# Altium schematic sheet SCIENCE.SchDoc
size A4; SheetNumber: 1; SheetTotal: 2
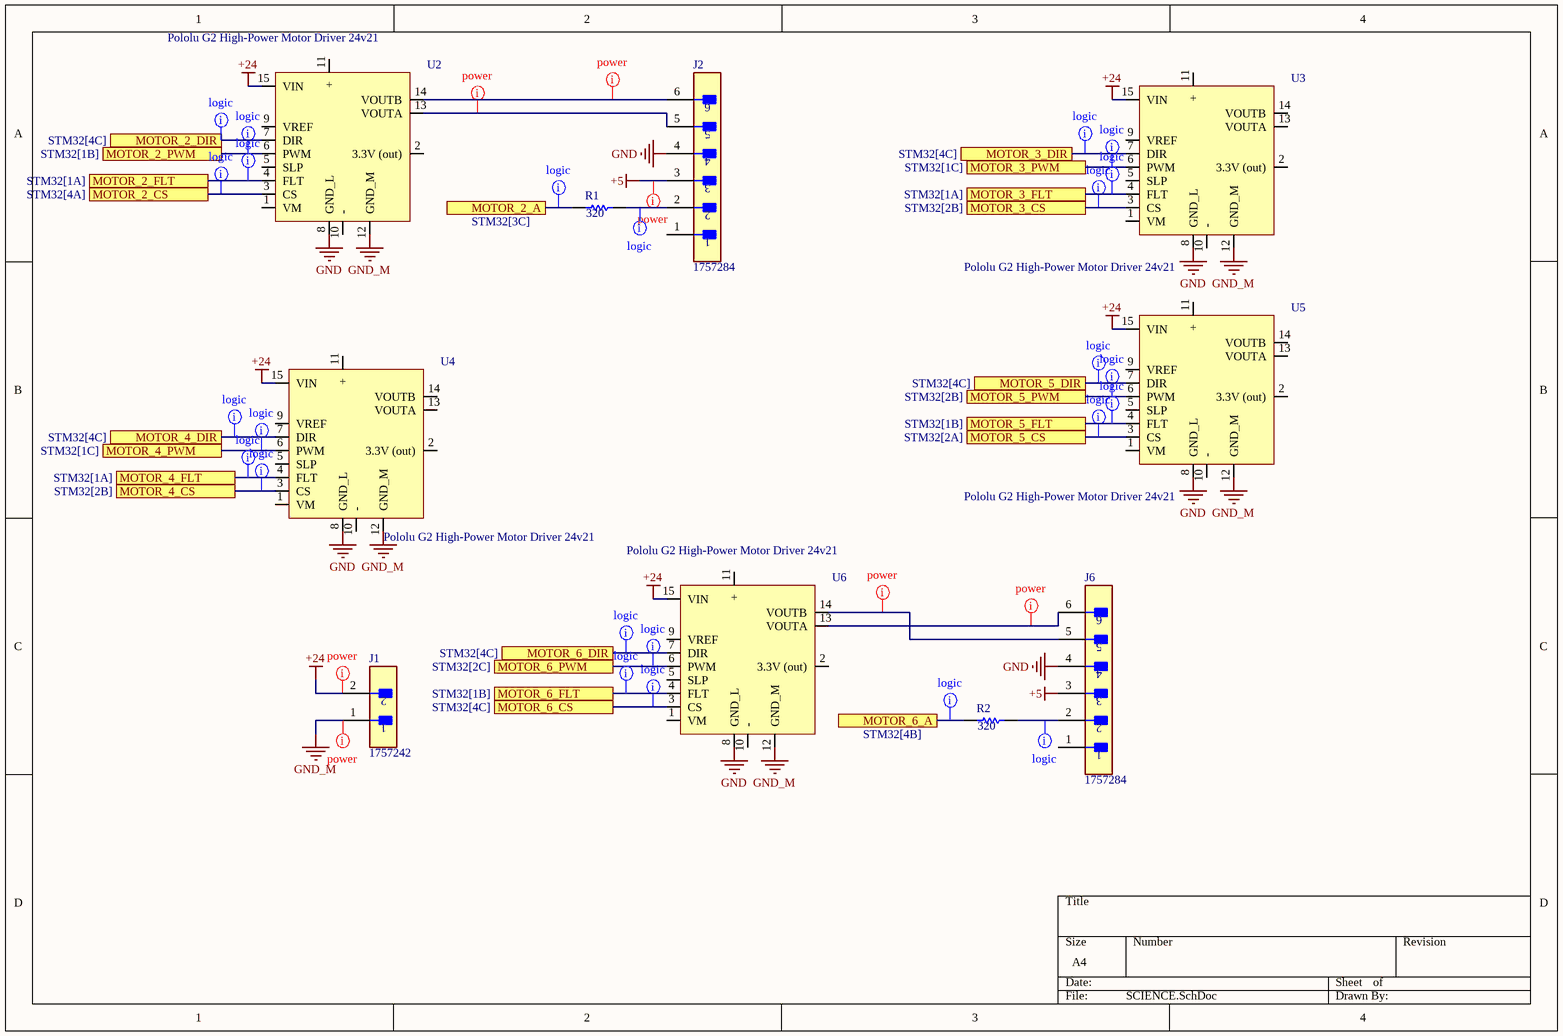
[diagram p0: SCIENCE.SchDoc]

## Parts
J1  1757242  [FP-1757242-MFG]
J2  1757284  [FP-1757284-MFG]
J6  1757284  [FP-1757284-MFG]
R1  value 320  [AXIAL-0.3]  (hidden comment: Res1)
R2  value 320  [AXIAL-0.3]  (hidden comment: Res1)
U2  Pololu G2 High-Power Motor Driver 24v21  [Pololu G2 High-Power Motor Driver 24v21]
U3  Pololu G2 High-Power Motor Driver 24v21  [Pololu G2 High-Power Motor Driver 24v21]
U4  Pololu G2 High-Power Motor Driver 24v21  [Pololu G2 High-Power Motor Driver 24v21]
U5  Pololu G2 High-Power Motor Driver 24v21  [Pololu G2 High-Power Motor Driver 24v21]
U6  Pololu G2 High-Power Motor Driver 24v21  [Pololu G2 High-Power Motor Driver 24v21]

## Ports
MOTOR_2_A (see STM32[3C]), MOTOR_2_CS (see STM32[4A]), MOTOR_2_DIR (see STM32[4C]), MOTOR_2_FLT (see STM32[1A]), MOTOR_2_PWM (see STM32[1B]), MOTOR_3_CS (see STM32[2B]), MOTOR_3_DIR (see STM32[4C]), MOTOR_3_FLT (see STM32[1A]), MOTOR_3_PWM (see STM32[1C]), MOTOR_4_CS (see STM32[2B]), MOTOR_4_DIR (see STM32[4C]), MOTOR_4_FLT (see STM32[1A]), MOTOR_4_PWM (see STM32[1C]), MOTOR_5_CS (see STM32[2A]), MOTOR_5_DIR (see STM32[4C]), MOTOR_5_FLT (see STM32[1B]), MOTOR_5_PWM (see STM32[2B]), MOTOR_6_A (see STM32[4B]), MOTOR_6_CS (see STM32[4C]), MOTOR_6_DIR (see STM32[4C]), MOTOR_6_FLT (see STM32[1B]), MOTOR_6_PWM (see STM32[2C])

## Nets
+5: J2.3 J6.3
+24: J1.2 U2.15(VIN) U3.15(VIN) U4.15(VIN) U5.15(VIN) U6.15(VIN)
GND: J2.4 J6.4 U2.8(GND_L) U3.8(GND_L) U4.8(GND_L) U5.8(GND_L) U6.8(GND_L)
GND_M: J1.1 U2.12(GND_M) U3.12(GND_M) U4.12(GND_M) U5.12(GND_M) U6.12(GND_M)
MOTOR_2_A: R1.1 ; port MOTOR_2_A
MOTOR_2_CS: U2.3(CS) ; port MOTOR_2_CS
MOTOR_2_DIR: U2.7(DIR) ; port MOTOR_2_DIR
MOTOR_2_FLT: U2.4(FLT) ; port MOTOR_2_FLT
MOTOR_2_PWM: U2.6(PWM) ; port MOTOR_2_PWM
MOTOR_3_CS: U3.3(CS) ; port MOTOR_3_CS
MOTOR_3_DIR: U3.7(DIR) ; port MOTOR_3_DIR
MOTOR_3_FLT: U3.4(FLT) ; port MOTOR_3_FLT
MOTOR_3_PWM: U3.6(PWM) ; port MOTOR_3_PWM
MOTOR_4_CS: U4.3(CS) ; port MOTOR_4_CS
MOTOR_4_DIR: U4.7(DIR) ; port MOTOR_4_DIR
MOTOR_4_FLT: U4.4(FLT) ; port MOTOR_4_FLT
MOTOR_4_PWM: U4.6(PWM) ; port MOTOR_4_PWM
MOTOR_5_CS: U5.3(CS) ; port MOTOR_5_CS
MOTOR_5_DIR: U5.7(DIR) ; port MOTOR_5_DIR
MOTOR_5_FLT: U5.4(FLT) ; port MOTOR_5_FLT
MOTOR_5_PWM: U5.6(PWM) ; port MOTOR_5_PWM
MOTOR_6_A: R2.1 ; port MOTOR_6_A
MOTOR_6_CS: U6.3(CS) ; port MOTOR_6_CS
MOTOR_6_DIR: U6.7(DIR) ; port MOTOR_6_DIR
MOTOR_6_FLT: U6.4(FLT) ; port MOTOR_6_FLT
MOTOR_6_PWM: U6.6(PWM) ; port MOTOR_6_PWM
NetJ2_2: J2.2 R1.2
NetJ2_5: J2.5 U2.13(VOUTA)
NetJ2_6: J2.6 U2.14(VOUTB)
NetJ6_2: J6.2 R2.2
NetJ6_5: J6.5 U6.14(VOUTB)
NetJ6_6: J6.6 U6.13(VOUTA)

Not connected (* = marked no-connect by the designer): J2 1; J6 1; U2 1(VM) 2(3.3V_(out)) 5(SLP) 9(VREF) 10(-) 11(+); U3 1(VM) 2(3.3V_(out)) 5(SLP) 9(VREF) 10(-) 11(+) 13(VOUTA) 14(VOUTB); U4 1(VM) 2(3.3V_(out)) 5(SLP) 9(VREF) 10(-) 11(+) 13(VOUTA) 14(VOUTB); U5 1(VM) 2(3.3V_(out)) 5(SLP) 9(VREF) 10(-) 11(+) 13(VOUTA) 14(VOUTB); U6 1(VM) 2(3.3V_(out)) 5(SLP) 9(VREF) 10(-) 11(+)

## Layout directives
net class power: +5, +24, GND_M, NetJ2_5, NetJ2_6, NetJ6_5, NetJ6_6
net class logic: MOTOR_2_A, MOTOR_2_CS, MOTOR_2_DIR, MOTOR_2_FLT, MOTOR_2_PWM, MOTOR_3_CS, MOTOR_3_DIR, MOTOR_3_FLT, MOTOR_3_PWM, MOTOR_4_CS, MOTOR_4_DIR, MOTOR_4_FLT, MOTOR_4_PWM, MOTOR_5_CS, MOTOR_5_DIR, MOTOR_5_FLT, MOTOR_5_PWM, MOTOR_6_A, MOTOR_6_CS, MOTOR_6_DIR, MOTOR_6_FLT, MOTOR_6_PWM, NetJ2_2, NetJ6_2

## Library data of the parts
J1 = CMP-09399-000010-1: TERM BLOCK HDR 2POS 90DEG 5.08MM; Number of Poles: 2; Voltage Rating (DC): 320V; Number of Levels: 1; Voltage Rating: 250V; Current: 15A; Gender: Male; Current Rating: 12A; Voltage: 300V; Approvals: UL; Connector Type: Plug; Package Quantity: 50; Weight: 5.396916oz; Mount: Through Hole; Lead Free: Lead Free; Depth: 12mm; Contact Plating: Tin; Housing Material: PBT; Color: Grey; REACH SVHC: No SVHC; Number of Contacts: 2; Flammability Rating: UL94 V-0; Length: 12.16mm; Housing Color: Green; RoHS Compliant: Yes; Contact Material: Tin; Height: 12.08mm; Orientation: Right Angle; Termination: Solder; Pitch: 5.08mm; Number of Positions: 2; Packaging: Bulk; Number of Rows: 1; Number of Positions Per Level: 2; Width: 12.1mm; Max Current Rating: 12A; Series: MSTBA
J2 J6 = CMP-09399-000007-1: TERM BLOCK HDR 6POS 90DEG 5.08MM; Gender: Male; Voltage Rating: 250V; Max Current Rating: 12A; Number of Positions: 6; Current: 15A; Approvals: UL; Number of Levels: 1; Voltage: 300V; Voltage Rating (DC): 320V; Connector Type: Plug; Termination: Solder; Weight: 5.396916oz; Flammability Rating: UL94 V-0; Packaging: Bulk; Package Quantity: 50; Contact Plating: Tin; REACH SVHC: No SVHC; Color: Grey; Current Rating: 12A; Mount: Through Hole; Height: 12.1mm; Number of Rows: 1; Number of Contacts: 6; Housing Material: Polybutylene; Series: MSTBA; Pitch: 5.08mm; RoHS Compliant: Yes; Orientation: Right Angle; Housing Color: Green; Length: 32.48mm; Number of Positions Per Level: 6; Width: 32.4mm; Depth: 12mm; Lead Free: Lead Free; Contact Material: Tin; Number of Poles: 6
R1 R2 = Res1: Resistor; Published: 8-Jun-2000; LatestRevisionDate: 17-Jul-2002; LatestRevisionNote: Re-released for DXP Platform.; PackageReference: AXIAL-0.3; Publisher: Altium Limited; PackageDescription: Axial Device, Thru-Hole; 2 Leads; 0.3 in Pin Spacing